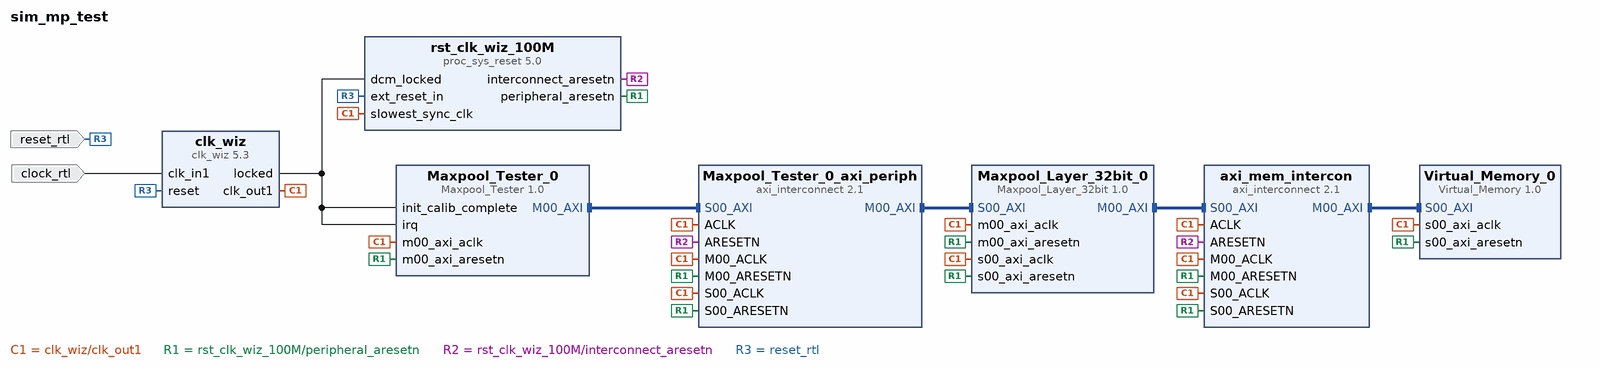
[diagram p0: block diagram of the top level]
# Vivado block design sim_mp_test, xc7a100tcsg324-1, Vivado 2016.4
create_bd_design sim_mp_test

create_bd_port -dir I -type rst reset_rtl
set_property -dict {CONFIG.POLARITY ACTIVE_HIGH} [get_bd_ports reset_rtl]
create_bd_port -dir I -type clk clock_rtl
set_property -dict {CONFIG.FREQ_HZ 100000000 CONFIG.PHASE 0.000} [get_bd_ports clock_rtl]

create_bd_cell -type ip -vlnv xilinx.com:user:Maxpool_Tester:1.0 Maxpool_Tester_0
create_bd_cell -type ip -vlnv xilinx.com:user:Virtual_Memory:1.0 Virtual_Memory_0
create_bd_cell -type ip -vlnv xilinx.com:ip:axi_interconnect:2.1 Maxpool_Tester_0_axi_periph
set_property -dict {CONFIG.NUM_MI 1} [get_bd_cells Maxpool_Tester_0_axi_periph]
create_bd_cell -type ip -vlnv xilinx.com:ip:clk_wiz:5.3 clk_wiz
create_bd_cell -type ip -vlnv xilinx.com:ip:proc_sys_reset:5.0 rst_clk_wiz_100M
create_bd_cell -type ip -vlnv xilinx.com:ip:axi_interconnect:2.1 axi_mem_intercon
set_property -dict {CONFIG.NUM_MI 1} [get_bd_cells axi_mem_intercon]
create_bd_cell -type ip -vlnv xilinx.com:user:Maxpool_Layer_32bit:1.0 Maxpool_Layer_32bit_0

# ---- connections ----

connect_bd_intf_net [get_bd_intf_pins Maxpool_Tester_0/M00_AXI] [get_bd_intf_pins Maxpool_Tester_0_axi_periph/S00_AXI]
connect_bd_intf_net [get_bd_intf_pins Maxpool_Tester_0_axi_periph/M00_AXI] [get_bd_intf_pins Maxpool_Layer_32bit_0/S00_AXI]
connect_bd_intf_net [get_bd_intf_pins Maxpool_Layer_32bit_0/M00_AXI] [get_bd_intf_pins axi_mem_intercon/S00_AXI]
connect_bd_intf_net [get_bd_intf_pins axi_mem_intercon/M00_AXI] [get_bd_intf_pins Virtual_Memory_0/S00_AXI]
connect_bd_net [get_bd_pins clk_wiz/clk_out1] \
  [get_bd_pins Maxpool_Tester_0/m00_axi_aclk] [get_bd_pins Maxpool_Tester_0_axi_periph/S00_ACLK] \
  [get_bd_pins rst_clk_wiz_100M/slowest_sync_clk] [get_bd_pins Maxpool_Tester_0_axi_periph/ACLK] \
  [get_bd_pins Maxpool_Tester_0_axi_periph/M00_ACLK] [get_bd_pins axi_mem_intercon/S00_ACLK] \
  [get_bd_pins axi_mem_intercon/ACLK] [get_bd_pins Virtual_Memory_0/s00_axi_aclk] [get_bd_pins axi_mem_intercon/M00_ACLK] \
  [get_bd_pins Maxpool_Layer_32bit_0/m00_axi_aclk] [get_bd_pins Maxpool_Layer_32bit_0/s00_axi_aclk]
connect_bd_net [get_bd_pins clk_wiz/locked] \
  [get_bd_pins rst_clk_wiz_100M/dcm_locked] [get_bd_pins Maxpool_Tester_0/init_calib_complete] \
  [get_bd_pins Maxpool_Tester_0/irq]
connect_bd_net [get_bd_pins rst_clk_wiz_100M/peripheral_aresetn] \
  [get_bd_pins Maxpool_Tester_0/m00_axi_aresetn] [get_bd_pins Maxpool_Tester_0_axi_periph/S00_ARESETN] \
  [get_bd_pins Maxpool_Tester_0_axi_periph/M00_ARESETN] [get_bd_pins axi_mem_intercon/S00_ARESETN] \
  [get_bd_pins Virtual_Memory_0/s00_axi_aresetn] [get_bd_pins axi_mem_intercon/M00_ARESETN] \
  [get_bd_pins Maxpool_Layer_32bit_0/m00_axi_aresetn] [get_bd_pins Maxpool_Layer_32bit_0/s00_axi_aresetn]
connect_bd_net [get_bd_pins rst_clk_wiz_100M/interconnect_aresetn] \
  [get_bd_pins Maxpool_Tester_0_axi_periph/ARESETN] [get_bd_pins axi_mem_intercon/ARESETN]
connect_bd_net [get_bd_ports reset_rtl] [get_bd_pins clk_wiz/reset] [get_bd_pins rst_clk_wiz_100M/ext_reset_in]
connect_bd_net [get_bd_ports clock_rtl] [get_bd_pins clk_wiz/clk_in1]

# ---- address map ----
assign_bd_address -offset 0x76000000 -range 64K -target_address_space [get_bd_addr_spaces Maxpool_Layer_32bit_0/M00_AXI] [get_bd_addr_segs Virtual_Memory_0/S00_AXI/S00_AXI_mem]
assign_bd_address -offset 0x44A00000 -range 64K -target_address_space [get_bd_addr_spaces Maxpool_Tester_0/M00_AXI] [get_bd_addr_segs Maxpool_Layer_32bit_0/S00_AXI/S00_AXI_reg]

validate_bd_design
save_bd_design
